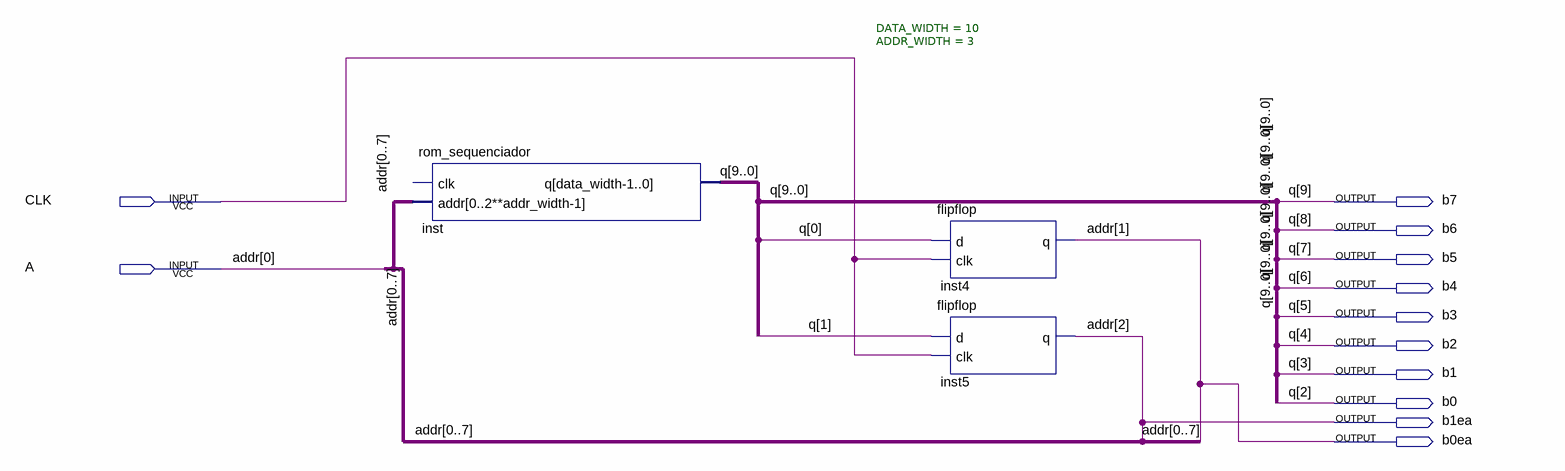
[diagram p0: schematic sheet]
// Quartus schematic fsm_rom_sequenciador.bdf as structural Verilog: 3 symbols, 12 pins
module fsm_rom_sequenciador (
  input  CLK,
  input  A,
  output b7,
  output b6,
  output b5,
  output b4,
  output b3,
  output b2,
  output b1,
  output b0,
  output b1ea,
  output b0ea
);

  wire [1:0] q;
  wire [7:3] addr;

  rom_sequenciador #(.DATA_WIDTH(10), .ADDR_WIDTH(3)) inst (
    .addr({A, b0ea, b1ea, addr[3], addr[4], addr[5], addr[6], addr[7]}),
    .q({b7, b6, b5, b4, b3, b2, b1, b0, q}));  // open: clk
  flipflop inst4 (.d(q[0]), .clk(CLK), .q(b0ea));
  flipflop inst5 (.d(q[1]), .clk(CLK), .q(b1ea));

  // Other names for the same wires on the sheet: addr[2:0] = {b1ea, b0ea, A};
  //   q[9:2] = {b7, b6, b5, b4, b3, b2, b1, b0}
endmodule
